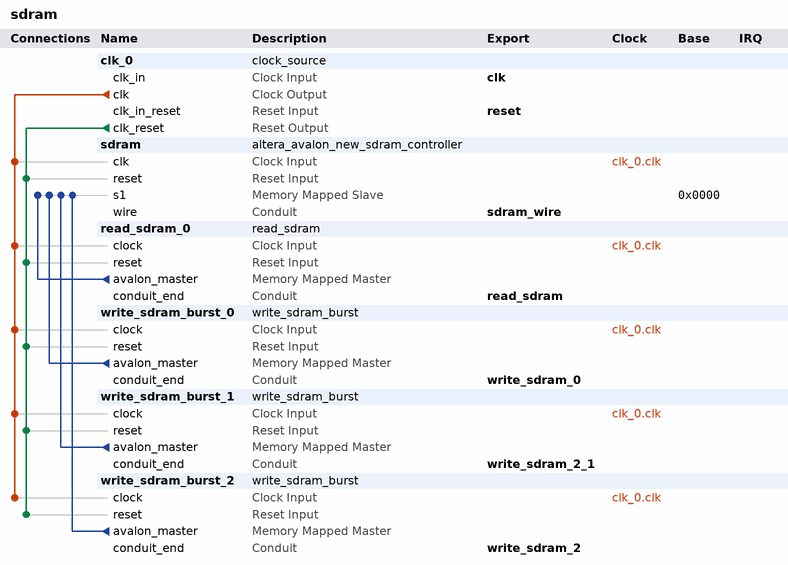
[diagram p0: system contents]
# Platform Designer (Qsys) system sdram, Cyclone IV E EP4CE10E22I7
# Parameters at their usual value, and those the tool derives, are not listed.
package require -exact qsys 13.1
create_system sdram
set_project_property DEVICE_FAMILY {Cyclone IV E}
set_project_property DEVICE EP4CE10E22I7

add_instance clk_0 clock_source 13.1
set_instance_parameter_value clk_0 clockFrequency 50000000

add_instance sdram altera_avalon_new_sdram_controller 13.1
set_instance_parameter_value sdram TAC 5.5
set_instance_parameter_value sdram TRCD 20.0
set_instance_parameter_value sdram TRP 20.0
set_instance_parameter_value sdram casLatency 3
set_instance_parameter_value sdram columnWidth 8
set_instance_parameter_value sdram dataWidth 16
set_instance_parameter_value sdram generateSimulationModel true
set_instance_parameter_value sdram model single_Micron_MT48LC4M32B2_7_chip
set_instance_parameter_value sdram numberOfBanks 4
set_instance_parameter_value sdram numberOfChipSelects 1
set_instance_parameter_value sdram powerUpDelay 100.0
set_instance_parameter_value sdram refreshPeriod 15.625
set_instance_parameter_value sdram rowWidth 12

add_instance read_sdram_0 read_sdram 1.0
set_instance_parameter_value read_sdram_0 IDLE 0
set_instance_parameter_value read_sdram_0 START 1
set_instance_parameter_value read_sdram_0 READING 2
set_instance_parameter_value read_sdram_0 FINISH 3

add_instance write_sdram_burst_0 write_sdram_burst 1.0
set_instance_parameter_value write_sdram_burst_0 IDLE 1
set_instance_parameter_value write_sdram_burst_0 START 2
set_instance_parameter_value write_sdram_burst_0 PREPARE_DAT_AND_ADDR 4
set_instance_parameter_value write_sdram_burst_0 WRITE_EN 8
set_instance_parameter_value write_sdram_burst_0 WAIT_WRITE_SUCCESS 16
set_instance_parameter_value write_sdram_burst_0 WRITE_SUCCESS 32
set_instance_parameter_value write_sdram_burst_0 BURST_CNT 16

add_instance write_sdram_burst_1 write_sdram_burst 1.0
set_instance_parameter_value write_sdram_burst_1 IDLE 1
set_instance_parameter_value write_sdram_burst_1 START 2
set_instance_parameter_value write_sdram_burst_1 PREPARE_DAT_AND_ADDR 4
set_instance_parameter_value write_sdram_burst_1 WRITE_EN 8
set_instance_parameter_value write_sdram_burst_1 WAIT_WRITE_SUCCESS 16
set_instance_parameter_value write_sdram_burst_1 WRITE_SUCCESS 32
set_instance_parameter_value write_sdram_burst_1 BURST_CNT 16

add_instance write_sdram_burst_2 write_sdram_burst 1.0
set_instance_parameter_value write_sdram_burst_2 IDLE 1
set_instance_parameter_value write_sdram_burst_2 START 2
set_instance_parameter_value write_sdram_burst_2 PREPARE_DAT_AND_ADDR 4
set_instance_parameter_value write_sdram_burst_2 WRITE_EN 8
set_instance_parameter_value write_sdram_burst_2 WAIT_WRITE_SUCCESS 16
set_instance_parameter_value write_sdram_burst_2 WRITE_SUCCESS 32
set_instance_parameter_value write_sdram_burst_2 BURST_CNT 16

# connections
add_connection clk_0.clk read_sdram_0.clock clock
add_connection clk_0.clk sdram.clk clock
add_connection clk_0.clk write_sdram_burst_0.clock clock
add_connection clk_0.clk write_sdram_burst_1.clock clock
add_connection clk_0.clk write_sdram_burst_2.clock clock
add_connection clk_0.clk_reset read_sdram_0.reset reset
add_connection clk_0.clk_reset sdram.reset reset
add_connection clk_0.clk_reset write_sdram_burst_0.reset reset
add_connection clk_0.clk_reset write_sdram_burst_1.reset reset
add_connection clk_0.clk_reset write_sdram_burst_2.reset reset
add_connection read_sdram_0.avalon_master sdram.s1 avalon
set_connection_parameter_value read_sdram_0.avalon_master/sdram.s1 baseAddress 0x0000
add_connection write_sdram_burst_0.avalon_master sdram.s1 avalon
set_connection_parameter_value write_sdram_burst_0.avalon_master/sdram.s1 baseAddress 0x0000
add_connection write_sdram_burst_1.avalon_master sdram.s1 avalon
set_connection_parameter_value write_sdram_burst_1.avalon_master/sdram.s1 baseAddress 0x0000
add_connection write_sdram_burst_2.avalon_master sdram.s1 avalon
set_connection_parameter_value write_sdram_burst_2.avalon_master/sdram.s1 baseAddress 0x0000

# exported interfaces
add_interface clk clock sink
set_interface_property clk EXPORT_OF clk_0.clk_in
add_interface reset reset sink
set_interface_property reset EXPORT_OF clk_0.clk_in_reset
add_interface read_sdram conduit end
set_interface_property read_sdram EXPORT_OF read_sdram_0.conduit_end
add_interface write_sdram_2 conduit end
set_interface_property write_sdram_2 EXPORT_OF write_sdram_burst_2.conduit_end
add_interface write_sdram_2_1 conduit end
set_interface_property write_sdram_2_1 EXPORT_OF write_sdram_burst_1.conduit_end
add_interface write_sdram_0 conduit end
set_interface_property write_sdram_0 EXPORT_OF write_sdram_burst_0.conduit_end
add_interface sdram_wire conduit end
set_interface_property sdram_wire EXPORT_OF sdram.wire

set_interconnect_requirement {$system} qsys_mm.clockCrossingAdapter HANDSHAKE
set_interconnect_requirement {$system} qsys_mm.maxAdditionalLatency 1
set_interconnect_requirement {$system} qsys_mm.insertDefaultSlave false

save_system sdram.qsys
